# Altium schematic sheet USB_Port_FTT.SchDoc
size 431 x 279 mm; DrawnBy: Santiago Rodriguez; Revision: V1; SheetNumber: 3; SheetTotal: 9
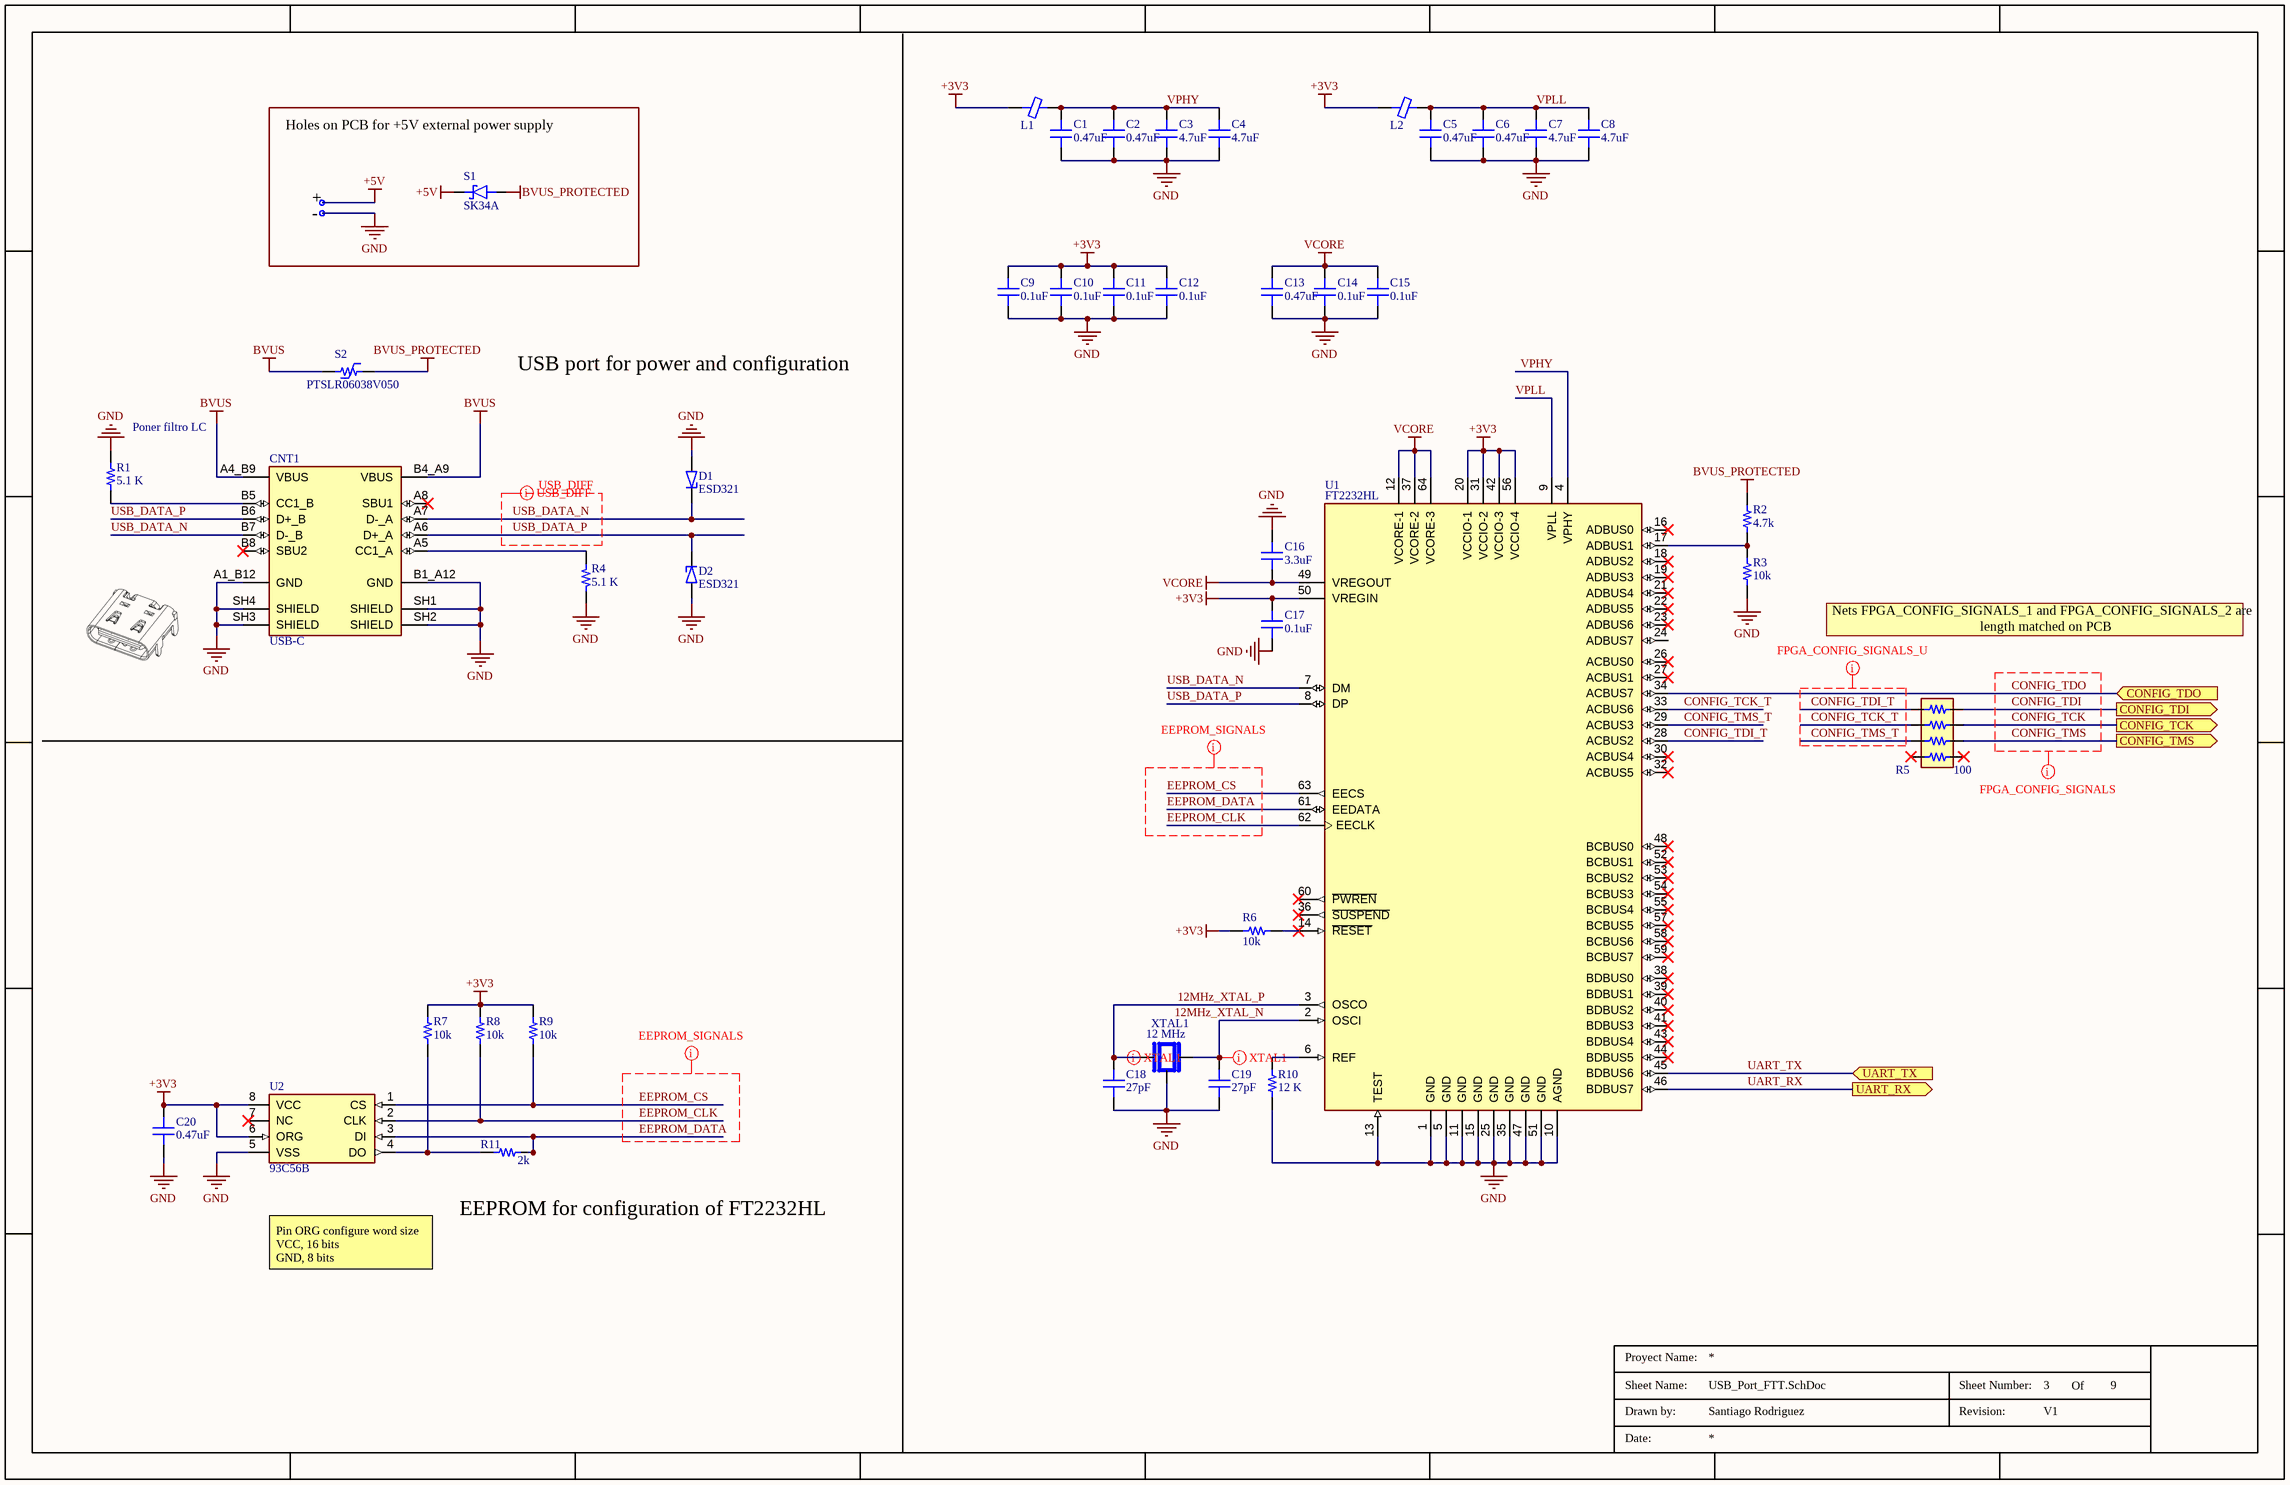
[diagram p0: USB_Port_FTT.SchDoc]

## Parts
C1  0.47uF  [CAP0402]
C2  0.47uF  [CAP0402]
C3  4.7uF  [CAP0402]
C4  4.7uF  [CAP0402]
C5  0.47uF  [CAP0402]
C6  0.47uF  [CAP0402]
C7  4.7uF  [CAP0402]
C8  4.7uF  [CAP0402]
C9  0.1uF  [CAP0402]
C10  0.1uF  [CAP0402]
C11  0.1uF  [CAP0402]
C12  0.1uF  [CAP0402]
C13  0.47uF  [CAP0402]
C14  0.1uF  [CAP0402]
C15  0.1uF  [CAP0402]
C16  3.3uF  [CAP0402]
C17  0.1uF  [CAP0402]
C18  27pF  [CAP0402]
C19  27pF  [CAP0402]
C20  0.47uF  [CAP0402]
CNT1  USB-C  [USB-C 2.0 24 PINS (16+8 DUMMY)]
D1  ESD321  [SOD-523]
D2  ESD321  [SOD-523]
L1  HZ0603C651R-10  [Fer0603]  (value not drawn)
L2  HZ0603C651R-10  [Fer0603]  (value not drawn)
R1  5.1 K  [RES0603]
R2  4.7k  [RES0402]
R3  10k  [RES0402]
R4  5.1 K  [RES0603]
R5  100  [ArrayResistor-1206]
R6  10k  [RES0402]
R7  10k  [RES0402]
R8  10k  [RES0402]
R9  10k  [RES0402]
R10  12 K  [RES0603]
R11  2k  [RES0402]
S1  SK34A  [Diode SMA-2]
S2  PTSLR06038V050  [PTSLR0603]
U1  FT2232HL  [LQPF-64]
U2  93C56B  [DFN-8]
XTAL1  12 MHz  [XTAL_ABM8G]

## Ports
CONFIG_TCK (out), CONFIG_TDI (out), CONFIG_TDO (in), CONFIG_TMS (out), UART_RX (out), UART_TX (in)

## Nets
+3V3: C9.2 C10.2 C11.2 C12.2 C17.2 C20.2 L1.1 L2.1 R6.1 R7.2 R8.2 R9.2 U1.20(VCCIO-1) U1.31(VCCIO-2) U1.42(VCCIO-3) U1.50(VREGIN) U1.56(VCCIO-4) U2.6(ORG) U2.8(VCC)
+5V: S1.C(K)
BVUS: CNT1.A4_B9(VBUS) CNT1.B4_A9(VBUS) S2.1
BVUS_PROTECTED: R2.2 S1.A S2.2
GND: C1.1 C2.1 C3.1 C4.1 C5.1 C6.1 C7.1 C8.1 C9.1 C10.1 C11.1 C12.1 C13.1 C14.1 C15.1 C16.2 C17.1 C18.1 C19.1 C20.1 CNT1.A1_B12(GND) CNT1.B1_A12(GND) CNT1.SH1(SHIELD) CNT1.SH2(SHIELD) CNT1.SH3(SHIELD) CNT1.SH4(SHIELD) D1.A D2.A R1.2 R3.1 R4.2 R10.1 U1.1(GND) U1.5(GND) U1.10(AGND) U1.11(GND) U1.13(TEST) U1.15(GND) U1.25(GND) U1.35(GND) U1.47(GND) U1.51(GND) U2.5(VSS) XTAL1.2
VCORE: C13.2 C14.2 C15.2 C16.1 U1.12(VCORE-1) U1.37(VCORE-2) U1.49(VREGOUT) U1.64(VCORE-3)
12MHz_XTAL_N: C19.2 U1.2(OSCI) XTAL1.3
12MHz_XTAL_P: C18.2 U1.3(OSCO) XTAL1.1
CONFIG_TCK: R5.7 ; port CONFIG_TCK
CONFIG_TCK_T: R5.3 U1.33(ACBUS6)
CONFIG_TDI: R5.8 ; port CONFIG_TDI
CONFIG_TDI_T: R5.1 U1.28(ACBUS2)
CONFIG_TDO: U1.34(ACBUS7) ; port CONFIG_TDO
CONFIG_TMS: R5.6 ; port CONFIG_TMS
CONFIG_TMS_T: R5.2 U1.29(ACBUS3)
EEPROM_CLK: R8.1 U1.62(EECLK) U2.2(CLK)
EEPROM_CS: R9.1 U1.63(EECS) U2.1(CS)
EEPROM_DATA: R11.2 U1.61(EEDATA) U2.3(DI)
UART_RX: U1.46(BDBUS7) ; port UART_RX
UART_TX: U1.45(BDBUS6) ; port UART_TX
USB_DATA_N: CNT1.A7(D-_A) CNT1.B7(D-_B) D1.K U1.7(DM)
USB_DATA_P: CNT1.A6(D+_A) CNT1.B6(D+_B) D2.K U1.8(DP)
VPHY: C1.2 C2.2 C3.2 C4.2 L1.2 U1.4(VPHY)
VPLL: C5.2 C6.2 C7.2 C8.2 L2.2 U1.9(VPLL)
NetCNT1_A5: CNT1.A5(CC1_A) R4.1
NetCNT1_B5: CNT1.B5(CC1_B) R1.1
NetR2_1: R2.1 R3.2 U1.17(ADBUS1)
NetR6_2: R6.2 U1.14(~{RESET})
NetR7_1: R7.1 R11.1 U2.4(DO)
NetR10_2: R10.2 U1.6(REF)

Not connected (* = marked no-connect by the designer): CNT1 A8(SBU1)* B8(SBU2)*; R5 4* 5*; U1 16(ADBUS0)* 18(ADBUS2)* 19(ADBUS3)* 21(ADBUS4)* 22(ADBUS5)* 23(ADBUS6)* 24(ADBUS7) 26(ACBUS0)* 27(ACBUS1)* 30(ACBUS4)* 32(ACBUS5)* 36(~{SUSPEND})* 38(BDBUS0)* 39(BDBUS1)* 40(BDBUS2)* 41(BDBUS3)* 43(BDBUS4)* 44(BDBUS5)* 48(BCBUS0)* 52(BCBUS1)* 53(BCBUS2)* 54(BCBUS3)* 55(BCBUS4)* 57(BCBUS5)* 58(BCBUS6)* 59(BCBUS7)* 60(~{PWREN})*; U2 7(NC)*

## Layout directives
differential pair: 12MHz_XTAL_N, 12MHz_XTAL_P
differential pair; differential pair class USB_DIFF: USB_DATA_N, USB_DATA_P
net class EEPROM_SIGNALS: EEPROM_CLK, EEPROM_CS, EEPROM_DATA
net class FPGA_CONFIG_SIGNALS: CONFIG_TCK, CONFIG_TDI, CONFIG_TDO, CONFIG_TMS
net class FPGA_CONFIG_SIGNALS_U: CONFIG_TCK_T, CONFIG_TDI_T, CONFIG_TMS_T

## Notes on the sheet
- Holes on PCB for +5V external power supply
- +
- -
- (near R1) Poner filtro LC
- USB port for power and configuration <MF-NSMF050>
- Nets FPGA_CONFIG_SIGNALS_1 and FPGA_CONFIG_SIGNALS_2 are
- length matched on PCB
- (near R11) EEPROM for configuration of FT2232HL <MF-NSMF050>
- Pin ORG configure word size
  VCC, 16 bits
  GND, 8 bits
- Proyect Name:
- Sheet Name:
- Drawn by:
- Revision:
- Sheet Number:
- Of
- Date:

## Library data of the parts
C1 C2 C5 C6 C13 C20 = C0402C474K8RAC: CAP CER 0.47uF 10V X7R 0402 10%; PartNumber: C0603C474K4RAC; Manufacturer: Kemet; ComponentLink1Description: DataSheet; ComponentLink1URL: https://content.kemet.com/datasheets/KEM_C1002_X7R_SMD.pdf; Size: 0402; ComponentLink2Description: DigiKey; ComponentLink2URL: https://www.digikey.com/en/products/filter/ceramic-capacitors/60?s=N4IgTCBcDaIMIAYAsCxyQdiQaQBwCUBBOEAXQF8g; ComponentLink3Description: ProductPage; ComponentLink3URL: https://www.kemet.com/en/us/product/C0805C474K4RACTU.html; Tolerance: 10%; Value: 0.47uF; Voltage: 10 V
C3 C4 C7 C8 = C0402C475M9PAC: CAP CER 4.7uF 6.3V X5R 0402 10%; Manufacturer: Kemet; Voltage: 16V; ComponentLink1Description: DataSheet; ComponentLink1URL: https://content.kemet.com/datasheets/KEM_C1002_X7R_SMD.pdf; Size: 0402; ComponentLink2Description: DigiKey; ComponentLink2URL: https://www.digikey.com/en/products/filter/ceramic-capacitors/60?s=N4IgTCBcDaIMIAYAsCxyQdgKwFsCcADgIYDGIAugL5A; PartNumber: C0402C475M9PAC; ComponentLink3Description: ProdructPage; ComponentLink3URL: https://www.kemet.com/en/us/search.html?q=C0402C475M9PAC; Value: 4.7uF; Tolerance: 10%
C9-C12 C14 C15 C17 = C0402C104K4RAC: CAP CER 0.1uF 16V X7R 0402 10%; Manufactuer: Kemet; ComponentLink1Description: DataSheet; ComponentLink1URL: https://content.kemet.com/datasheets/KEM_C1002_X7R_SMD.pdf; ComponentLink2Description: DigiKey; ComponentLink2URL: https://www.digikey.com/en/products/filter/ceramic-capacitors/60?s=N4IgTCBcDaIMIAYAsCxwIzINJIEoEE4QBdAXyA; Value: 0.1uF; Tolerance: 10%; Size: 0402; Voltage: 16V; PartNumber: C0402C104K4RAC
C16 = C0402C332K5RAC: CAP CER 3.3nF 50V X7R 0402 10%; Manufacturer: Kemet; ComponentLink1Description: DataSheet; ComponentLink1URL: https://content.kemet.com/datasheets/KEM_C1002_X7R_SMD.pdf; Size: 0402; ComponentLink2Description: DigiKey; ComponentLink2URL: https://www.digikey.com/en/products/filter/ceramic-capacitors/60?s=N4IgTCBcDaIMIAYAsCxwMzrAaQKwCUBBOEAXQF8g; Value: 3.3uF; PartNumber: C0402C332K5RAC; Tolerance: 10%; Voltage: 50V
C18 C19 = C0402C270K5RAC: CAP CER 27pF 50V X7R 0402 10%; Manufacturer: Kemet; ComponentLink1Description: DataSheet; ComponentLink1URL: https://content.kemet.com/datasheets/KEM_C1002_X7R_SMD.pdf; Size: 0402; ComponentLink2Description: DigiKey; ComponentLink2URL: https://www.digikey.com/en/products/detail/kemet/C0402C270K5RACTU/18167653?s=N4IgTCBcDaIMIAYAsCxzAdgQaQKwCUBBOEAXQF8g; Value: 27pF; Tolerance: 10%; PartNumber: C0402C270K5RAC; Voltage: 50V
CNT1 = USB-C: CONN USB2.0, TYP C, 24 PINS (16+8 DUMMY), SMD, RIGHT ANGLE; ComponentLink1Description: DigiKey; ComponentLink1URL: https://www.digikey.com/en/products/detail/amphenol-cs-commercial-products/12402012E212A/13683192; ComponentLink2Description: DataSheet; ComponentLink2URL: https://mm.digikey.com/Volume0/opasdata/d220001/medias/docus/2614/C12402012-4.pdf; Type: C 2.0; Pins: 24 (16+8 DUMMY)
D1 D2 = ESD321: 0.9pF 3.6V ±30kV ESD protection diode with 6.8V 16A TLP clamping for USB 2.0; Manufacturer: Texas Instruments; ComponentLink1Description: ProductPage; ComponentLink1URL: https://www.ti.com/product/ESD321; Package: SOD-523; ComponentLink2Description: DataSheet; ComponentLink2URL: https://www.ti.com/lit/ds/symlink/esd321.pdf?ts=1717079562669&ref_url=https%253A%252F%252Fwww.ti.com%252Fproduct%252FESD321%253FkeyMatch%253DESD321%2526tisearch%253Dsearch-everything%2526usecase%253DGPN-ALT; ComponentLink3Description: DigyKey; ComponentLink3URL: https://www.digikey.com/en/products/detail/texas-instruments/ESD321DYAR/17394968; PartNumber: ESD321
L1 L2 = HZ0603C651R-10: FERRITE BEAD 650 OHM 0603 1LN 0603; Z@100MHz: 650 Ohms; Current: 300 mA; DCR: 0.6 Ohm; ComponentLink1Description: DataSheet; ComponentLink1URL: https://www.laird.com/sites/default/files/hz0603c651r-10-datasheet.pdf; ComponentLink2Description: DigiKey; ComponentLink2URL: https://www.digikey.com/es/products/detail/laird-signal-integrity-products/HZ0603C651R-10/806620?s=N4IgTCBcDaIBIC0AMA2JBmAwigrARgCUBaPJEAXQF8g; PartNumber: HZ0603C651R-10; Size: 0603
R1 R4 = CRCW06035K10FKEA: RES SMD 5.1K OHM 1% 1/10W 0603; Value: 47 K; ComponentLink1Description: DataSheet; ComponentLink1URL: https://www.vishay.com/docs/20035/dcrcwe3.pdf; Size: 0603; ComponentLink2Description: DigiKey; ComponentLink2URL: https://www.digikey.com/es/products/detail/vishay-dale/crcw06035k10fkea/1174748
R2 = CRCW04024K70FK: RES SMD 4.7K OHM 1% 0.063W 0402; Manufacturer: Vishay; ComponentLink1Description: DataSheet; ComponentLink1URL: https://www.vishay.com/docs/20035/dcrcwe3.pdf; Size: 0402; ComponentLink2Description: DigiKey; ComponentLink2URL: https://www.digikey.com/es/products/filter/resistor-de-chip-montaje-en-superficie/52?s=N4IgTCBcDaIMICU4HUAMAWVZ0GkDsqAYjiALoC%20QA; Power: 0.063 W; PartNumber: CRCW04024K70FK; Value: 4.7k; Tolerance: 1%
R3 R6-R9 = CRCW040210K0FK: RES SMD 10K OHM 1% 0.063W 0402; Manufacturer: Vishay; ComponentLink1Description: DataSheet; ComponentLink1URL: https://www.vishay.com/docs/20035/dcrcwe3.pdf; Size: 0402; ComponentLink2Description: DigiKey; ComponentLink2URL: https://www.digikey.com/en/products/filter/chip-resistor-surface-mount/52?s=N4IgTCBcDaIMICU4HUAMAWVYCMqDSqAYniALoC%20QA; Value: 10k; Tolerance: 1%; PartNumber: CRCW040210K0FK; Power: 0.063W
R5 = EXB-38V101JV: RES ARRAY 4 RES 100 OHM 1206; Elements: 4; Value: 100 Ohms; ComponentLink1Description: DigiKey; ComponentLink1URL: https://www.digikey.com/en/products/detail/panasonic-electronic-components/EXB-38V101JV/256519?s=N4IgTCBcDaIKIA0BCBaAzADgGoEYAMOAUliALoC%2BQA; ComponentLink2Description: DataSheet; ComponentLink2URL: https://industrial.panasonic.com/cdbs/www-data/pdf/AOC0000/AOC0000C14.pdf; Size: 1206
R10 = CRCW060312K0FKEA: RES SMD 12K OHM 1% 1/10W 0603; ComponentLink1Description: DataSheet; ComponentLink1URL: https://www.vishay.com/docs/20035/dcrcwe3.pdf; Size: 0603; ComponentLink2Description: DigiKey; ComponentLink2URL: https://www.digikey.com/en/products/detail/vishay-dale/CRCW060312K0FKEA/1174790
R11 = CRCW04022K00FK: RES SMD 2K OHM 1% 0.063W 0402; Manufacturer: Vishay; ComponentLink1Description: DataSheet; ComponentLink1URL: https://www.vishay.com/docs/20035/dcrcwe3.pdf; ComponentLink2Description: DigiKey; ComponentLink2URL: https://www.digikey.com/en/products/filter/chip-resistor-surface-mount/52?s=N4IgTCBcDaIMYCc4HcAMAWVYwGtWoDMcQBdAXyA; PartNumber: CRCW04022K00FK; Power: 0.063W; Value: 2k; Tolerance: 1%; Size: 0402
S1 = SK34A: Diode schottky 40V 3A; Manufacturer: SMC Diode Solutions; Forward Voltage Drop: 0.63; ComponentLink1Description: DigiKey; ComponentLink1URL: https://www.digikey.com/en/products/detail/smc-diode-solutions/SK34A/6022681; Peak Reverse Voltage: 40V; Forward Current: 3A; ComponentLink2Description: DataSheet; ComponentLink2URL: https://www.smc-diodes.com/propdf/SK34A%20N0103%20REV.C.pdf; Package: SMA-2; PartNumber: SK34A
S2 = PTSLR06038V050: PTC resettable fuse 500mA, 8V, 0603; Manufacturer: Eaton; Itrip: 1A; MaxCurrent: 25A; ComponentLink1Description: DataSheet; ComponentLink1URL: https://www.eaton.com/content/dam/eaton/products/electronic-components/resources/data-sheet/eaton-ptslr0603-surface-mount-resettable-fuse-data-sheet-elx1047-en.pdf; PartNumber: PTSLR06038V050; Size: 0603; Ihold: 500mA; ComponentLink2Description: DigiKey; ComponentLink2URL: https://www.digikey.com/es/products/detail/eaton-electronics-division/PTSLR06038V050/15193495?s=N4IgTCBcDaIAoBUDKAZASgBgGwYMwA4A1DAVgxAF0BfIA; MaxVoltage: 8V
U1 = FT2232HL: Dual High Speed USB to Multipurpose UART/FIFO IC; Manufacturer: FTDI Chip; ComponentLink1Description: DataSheet; ComponentLink1URL: https://ftdichip.com/wp-content/uploads/2020/07/DS_FT2232H.pdf; ComponentLink2Description: DigiKey; ComponentLink2URL: https://www.digikey.com/en/products/detail/ftdi-future-technology-devices-international-ltd/FT2232HL-REEL/1986053; Package: LQFP-64; PartNumber: FT2232HL
U2 = EEPROM: 2K Microwire Compatible Serial EEPROM; ComponentLink1Description: DataSheet; ComponentLink1URL: https://www.snapeda.com/parts/93C56BT-I/MC/Microchip/datasheet/
XTAL1 = XTAL_12MHz: Crystal 12 MHz; Manufacturer: Abracom; ComponentLink1Description: DataDheet; ComponentLink1URL: https://www.snapeda.com/parts/ABM8G-16.000MHZ-B4Y-T/Abracon/datasheet/; Frequency: 12 MHz; Series: ABM8G